# Altium schematic sheet BabyConditionMonitor.SchDoc: BabyConditionMonitor
size A2; DocumentNumber: 001; Revision: *.A; SheetNumber: 1; SheetTotal: 1
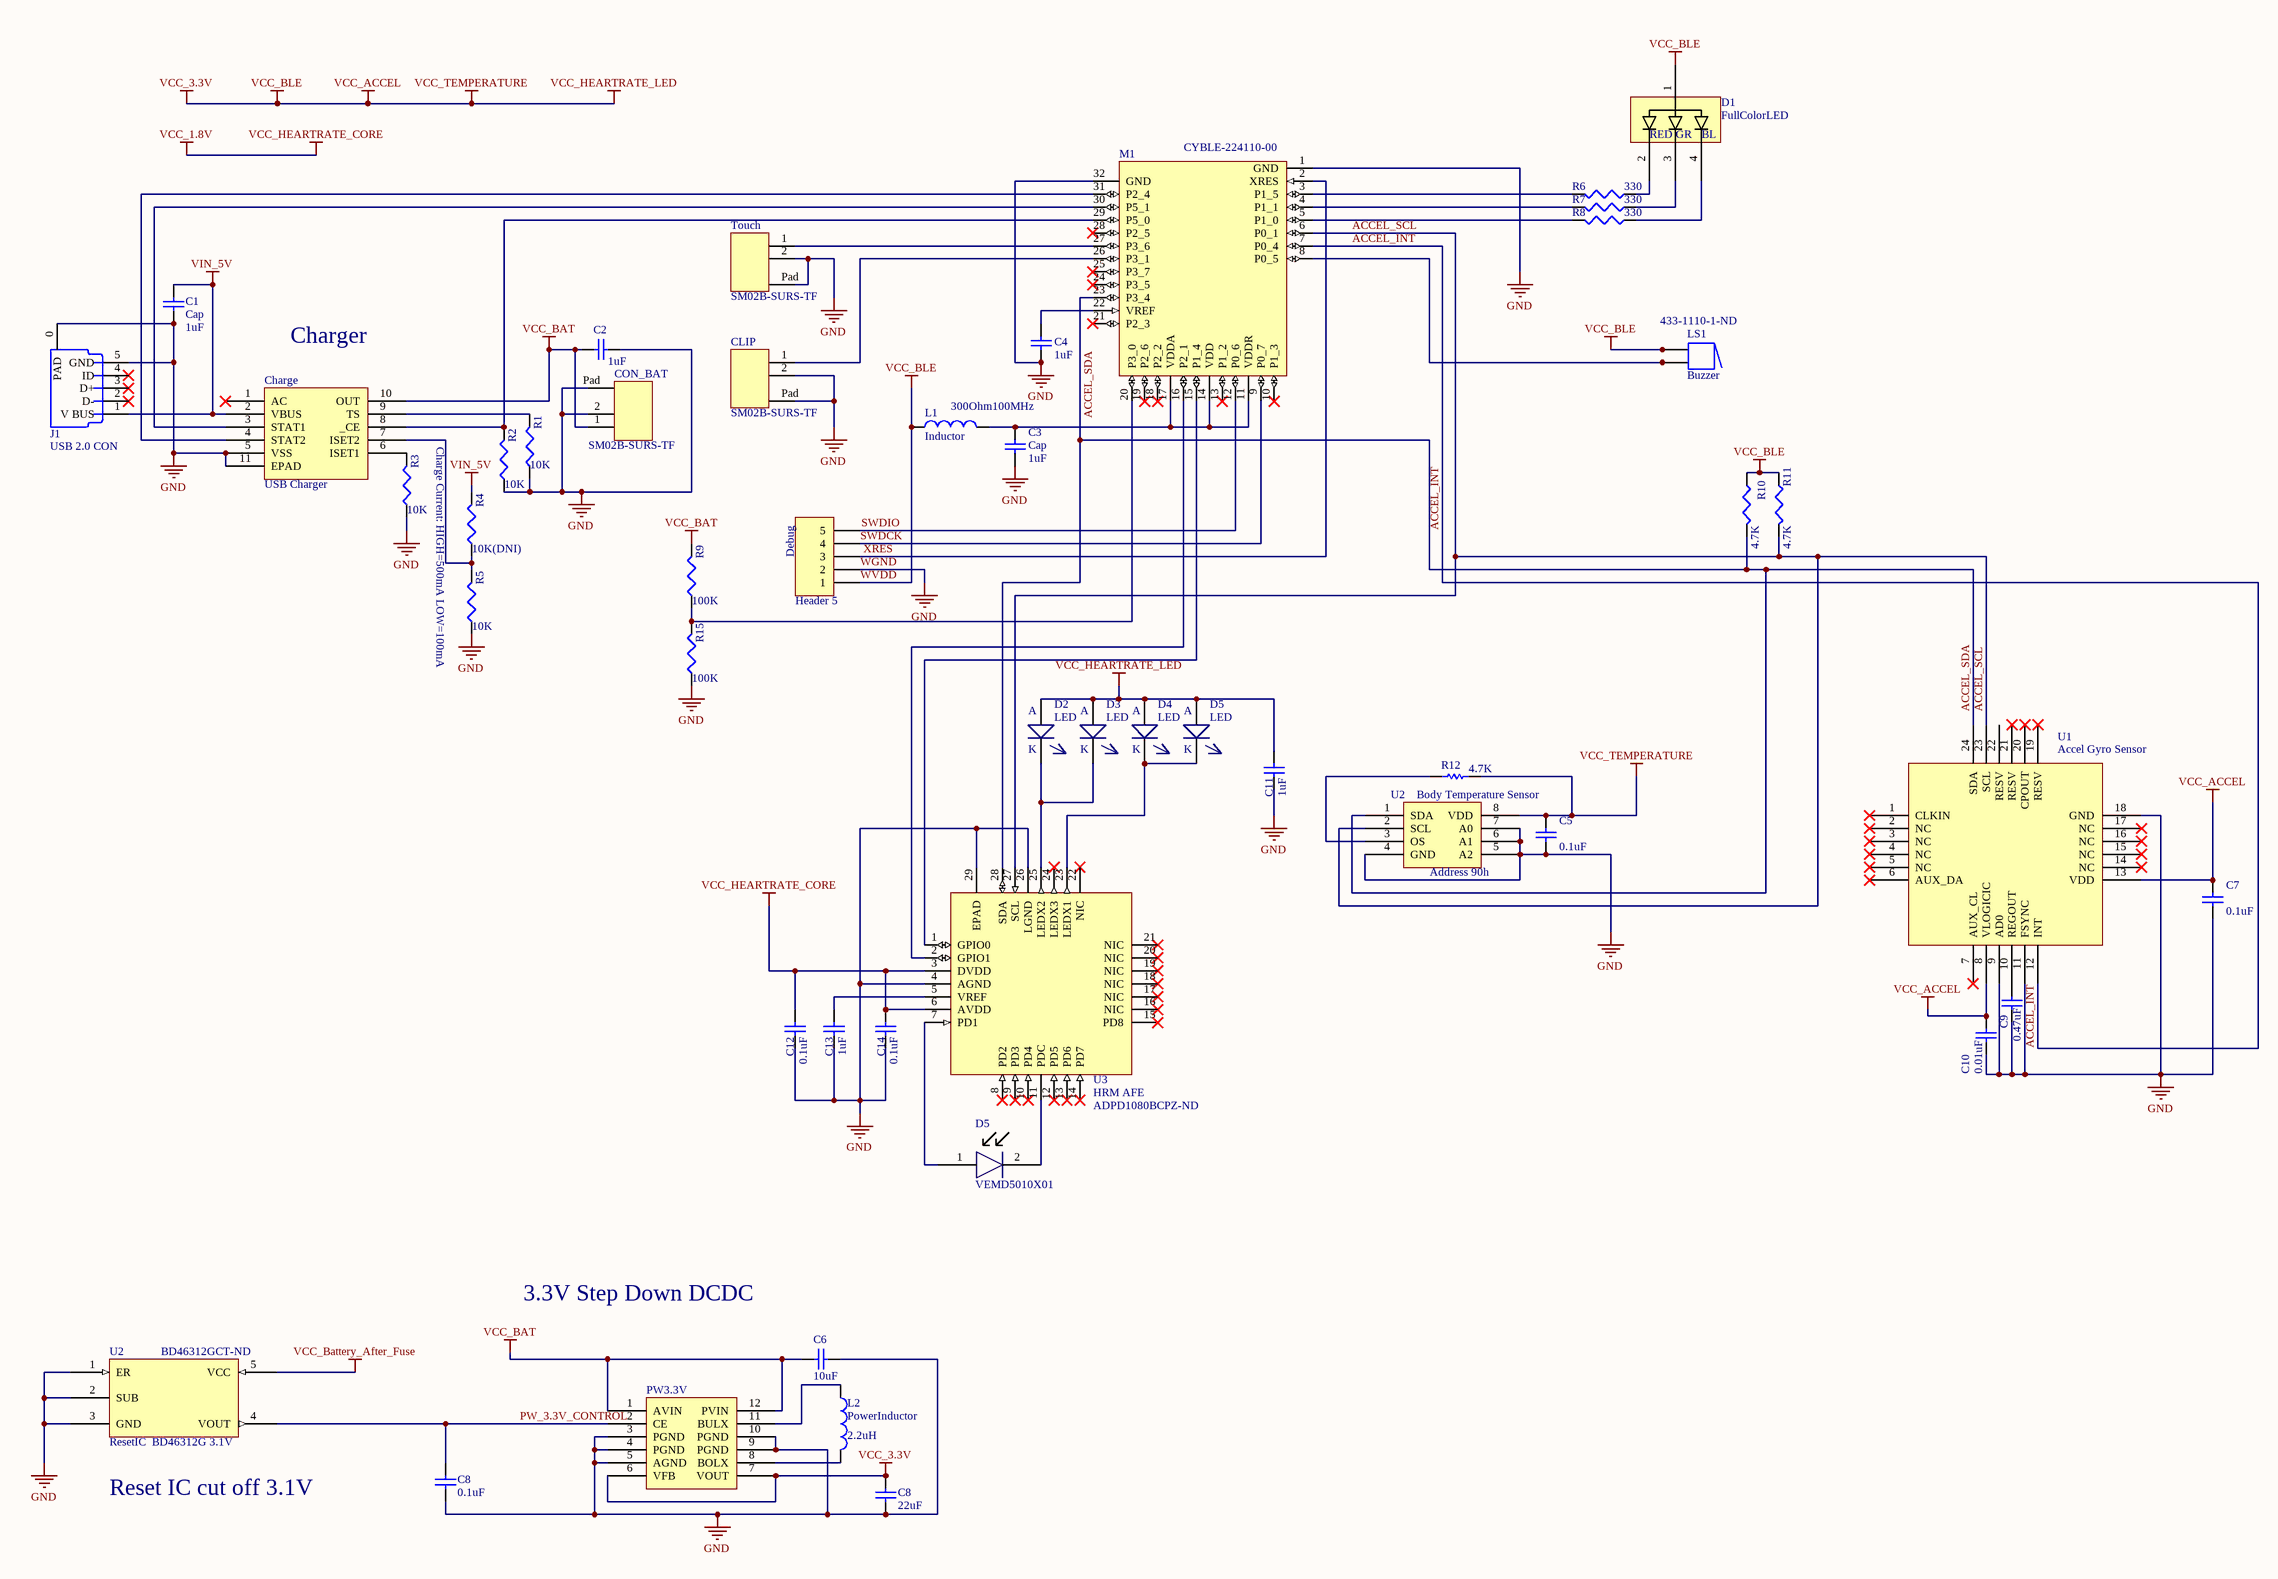
[diagram p0: BabyConditionMonitor.SchDoc]

## Parts
(Parts that share a designator on the sheet are numbered #1, #2 ... from top to bottom, then left to right.)
C1  Cap  value 1uF  [1005[0402] High Density]
C2  value 1uF  [1005[0402] High Density]  (hidden comment: Cap)
C3  Cap  value 1uF  [1005[0402] High Density]
C4  value 1uF  [1005[0402] High Density]  (hidden comment: Cap)
C5  value 0.1uF  [1005[0402] High Density]  (hidden comment: Cap)
C6  value 10uF  [1005[0402] High Density]  (hidden comment: Cap)
C7  value 0.1uF  [1005[0402] High Density]  (hidden comment: Cap)
C8#1  value 0.1uF  [1608[0603]]  (hidden comment: Cap)
C8#2  value 22uF  [1608[0603]]  (hidden comment: Cap)
C9  value 0.47uF  [1005[0402] High Density]  (hidden comment: Cap)
C10  value 0.01uF  [1005[0402] High Density]  (hidden comment: Cap)
C11  value 1uF  [1005[0402] High Density]  (hidden comment: Cap)
C12  value 0.1uF  [1005[0402] High Density]  (hidden comment: Cap)
C13  value 1uF  [1005[0402] High Density]  (hidden comment: Cap)
C14  value 0.1uF  [1005[0402] High Density]  (hidden comment: Cap)
Charge  USB Charger  [BQ24020]
CLIP  SM02B-SURS-TF  [SM02B-SURS-TF]
CON_BAT  SM02B-SURS-TF  [SM02B-SURS-TF]
D1  FullColorLED  [fullColorLED SMT]
D2  LED  [1608[0603] -LED]
D3  LED  [1608[0603] -LED]
D4  LED  [1608[0603] -LED]
D5#1  LED  [1608[0603] -LED]
D5#2  VEMD5010X01  [OPT Sensor VEMD5010X01]
Debug  Header 5  [MHDR1X5]
J1  USB 2.0 CON  [MicroUSB WaterProof]
L1  Inductor  value 300Ohm100MHz  [INDC1608L]
L2  PowerInductor  value 2.2uH  [Powerinductor]
LS1  Buzzer  Supplier Part Number 1: 433-1110-1-ND  [ST-0402T]
M1  CYBLE-224110-00  [CYBLE-224110-00]
PW3.3V  Buck Boost Converter  [RP604x]  (value not drawn)
R1  value 10K  [1005[0402] High Density]  (hidden comment: Res3)
R2  value 10K  [1005[0402] High Density]  (hidden comment: Res3)
R3  value 10K  [1005[0402] High Density]  (hidden comment: Res3)
R4  value 10K(DNI)  [1005[0402] High Density]  (hidden comment: Res3)
R5  value 10K  [1005[0402] High Density]  (hidden comment: Res3)
R6  value 330  [1005[0402] High Density]  (hidden comment: Res3)
R7  value 330  [1005[0402] High Density]  (hidden comment: Res3)
R8  value 330  [1005[0402] High Density]  (hidden comment: Res3)
R9  value 100K  [1005[0402] High Density]  (hidden comment: Res3)
R10  value 4.7K  [1005[0402] High Density]  (hidden comment: Res3)
R11  value 4.7K  [1005[0402] High Density]  (hidden comment: Res3)
R12  value 4.7K  [1005[0402] High Density]  (hidden comment: Res Semi)
R15  value 100K  [1005[0402] High Density]  (hidden comment: Res3)
Touch  SM02B-SURS-TF  [SM02B-SURS-TF]
U1  Accel Gyro Sensor  [MPU-6050]
U2#1  Body Temperature Sensor  [MAX30205]
U2#2  ResetIC  BD46312G 3.1V  Supplier Part Number 1: BD46312GCT-ND  [ResetIC  BD45xxx]
U3  HRM AFE  Supplier Part Number 1: ADPD1080BCPZ-ND  [ADPD1080]

## Nets
VCC_1.8V: C12.2 C14.2 U3.3(DVDD) U3.6(AVDD)  [also labelled VCC_HEARTRATE_CORE]
VCC_BAT: C2.1 C6.2 Charge.10(OUT) CON_BAT.1 PW3.3V.1(AVIN) PW3.3V.12(PVIN) R9.2
VCC_Battery_After_Fuse: U2#2.5(VCC)
VIN_5V: C1.1 Charge.2(VBUS) J1.1(V_BUS) R4.2
WGND: C1.2 C2.2 C3.1 C4.1 C5.1 C6.1 C7.1 C8#1.2 C8#2.2 C9.1 C10.1 C11.1 C12.1 C13.1 C14.1 Charge.5(VSS) Charge.11(EPAD) CLIP.2 CLIP.Pad CON_BAT.2 CON_BAT.Pad Debug.2 J1.0(PAD) J1.5(GND) M1.1(GND) M1.32(GND) PW3.3V.3(PGND) PW3.3V.4(PGND) PW3.3V.5(AGND) PW3.3V.9(PGND) PW3.3V.10(PGND) R1.1 R2.1 R3.1 R5.1 R15.1 Touch.2 Touch.Pad U1.9(AD0) U1.11(FSYNC) U1.18(GND) U2#1.4(GND) U2#1.5(A2) U2#1.6(A1) U2#1.7(A0) U2#2.1(ER) U2#2.2(SUB) U2#2.3(GND) U3.4(AGND) U3.26(LGND) U3.29(EPAD)  [also labelled GND]
WVDD: C5.2 C7.2 C8#2.1 C10.2 C11.2 D1.1 D2.1 D3.1 D4.1 D5#1.1 Debug.1 L1.1 LS1.1 LS1.1A PW3.3V.6(VFB) PW3.3V.7(VOUT) R10.1 R11.1 R12.1 U1.8(VLOGICIC) U1.13(VDD) U2#1.8(VDD)  [also labelled VCC_3.3V, VCC_ACCEL, VCC_BLE, VCC_HEARTRATE_LED, VCC_TEMPERATURE]
ACCEL_INT: M1.7(P0_4) U1.12(INT)
ACCEL_SCL: M1.6(P0_1) R11.2 U1.23(SCL) U2#1.2(SCL) U3.27(SCL)
ACCEL_SDA: M1.23(P3_4) R10.2 U1.24(SDA) U2#1.1(SDA) U3.28(SDA)
PW_3.3V_CONTROL: C8#1.1 PW3.3V.2(CE) U2#2.4(VOUT)
SWDCK: Debug.4 M1.9(P0_7)
SWDIO: Debug.5 M1.12(P0_6)
XRES: Debug.3 M1.2(XRES)
NetC3_2: C3.2 L1.2 M1.11(VDDR) M1.14(VDD) M1.17(VDDA)
NetC4_2: C4.2 M1.22(VREF)
NetC9_2: C9.2 U1.10(REGOUT)
NetC13_2: C13.2 U3.5(VREF)
NetCharge_3: Charge.3(STAT1) M1.30(P5_1)
NetCharge_4: Charge.4(STAT2) M1.31(P2_4)
NetCharge_6: Charge.6(ISET1) R3.2
NetCharge_7: Charge.7(ISET2) R4.1 R5.2
NetCharge_8: Charge.8(_CE) M1.29(P5_0) R2.2
NetCharge_9: Charge.9(TS) R1.2
NetCLIP_1: CLIP.1 M1.26(P3_1)
NetD1_2: D1.2 R6.1
NetD1_3: D1.3 R7.1
NetD1_4: D1.4 R8.1
NetD2_2: D2.2 D3.2 U3.25(LEDX2)
NetD4_2: D4.2 D5#1.2 U3.23(LEDX1)
NetD5#2_1: D5#2.1 U3.7(PD1)
NetD5#2_2: D5#2.2 U3.11(PDC)
NetL2_1: L2.1 PW3.3V.11(BULX)
NetL2_2: L2.2 PW3.3V.8(BOLX)
NetLS1_2: LS1.2 LS1.2A M1.8(P0_5)
NetM1_3: M1.3(P1_5) R6.2
NetM1_4: M1.4(P1_1) R7.2
NetM1_5: M1.5(P1_0) R8.2
NetM1_15: M1.15(P1_4) U3.1(GPIO0)
NetM1_16: M1.16(P2_1) U3.2(GPIO1)
NetM1_20: M1.20(P3_0) R9.1 R15.2
NetM1_27: M1.27(P3_6) Touch.1
NetR12_2: R12.2 U2#1.3(OS)

Not connected (* = marked no-connect by the designer): Charge 1(AC)*; J1 2(D-)* 3(D+)* 4(ID)*; M1 10(P1_3)* 13(P1_2)* 18(P2_2)* 19(P2_6)* 21(P2_3)* 24(P3_5)* 25(P3_7)* 28(P2_5)*; U1 1(CLKIN)* 2(NC)* 3(NC)* 4(NC)* 5(NC)* 6(AUX_DA)* 7(AUX_CL)* 14(NC)* 15(NC)* 16(NC)* 17(NC)* 19(RESV)* 20(CPOUT)* 21(RESV)* 22(RESV); U3 8(PD2)* 9(PD3)* 10(PD4)* 12(PD5)* 13(PD6)* 14(PD7)* 15(PD8)* 16(NIC)* 17(NIC)* 18(NIC)* 19(NIC)* 20(NIC)* 21(NIC)* 22(NIC)* 24(LEDX3)*

## Notes on the sheet
- Charger
- Charge Current: HIGH=500mA LOW=100mA
- (near U2#1) Address 90h
- 3.3V Step Down DCDC
- Reset IC cut off 3.1V
- Title
- Size:
- Date:
- File:
- A2
- Number:
- Time:
- Revision:
- Sheet
- of
- (in symbol FullColorLED) RED; GR; BL
- (in symbol LED) A; K

## Library data of the parts
C1-C7 C8#1 C8#2 C9-C14 = Cap: Capacitor; Published: 8-Jun-2000; LatestRevisionDate: 17-Jul-2002; LatestRevisionNote: Re-released for DXP Platform.; PackageReference: RAD-0.3; Publisher: Altium Limited; PackageDescription: Radial Cap, Thru-Hole; 2 Leads; 0.3 in Pin Spacing
Charge = BQ2402X: PartNo: BQ24020
D1 = FullColorLED: PartNo: OSTB0603C1C-A
D2-D4 D5#1 = LED: LED SMD; Manufacturer: Kingbright; Manufacturer Part Number: APTD1608CGCK; Description: LED GREEN CLEAR CHIP SMD; Color: Green; Forward Voltage: 2.1V; Luminous Intensity: 180mcd; Viewing Angle: 60°; Dominant Wavelength: 570nm; Test Current: 20mA; Lens Style: Clear; Supplier 1: Digi-Key; Supplier Part Number 1: 754-1545-1-ND; Stock 1: 692051; Pricing 1: 1=0.50000, 10=0.35300, 100=0.20580, 500=0.14112, 1000=0.11760 (USD); RoHS: Yes; Mount: Surface Mount; Case/Package: 0603; Case Code (Metric): 1608; Case Code (Imperial): 0603; Min Operating Temperature: -40°C; Max Operating Temperature: 85°C; Packaging: Tape and Reel; Package Quantity: 2000; Illumination Color: Green; Forward Current: 20mA; Length: 1.6mm; Height: 0.95mm; Width: 0.8mm; Lead Free: Lead Free; ComponentLink1URL: https://datasheet.ciiva.com/4688/aptd1608cgck-24861-4688176.pdf?src-supplier=Mouser; ComponentLink1Description: https://datasheet.ciiva.com/4688/aptd1608cgck-24861-4688176.pdf?src-supplier=Mouser; ComponentLink2URL: https://datasheet.ciiva.com/2114/aptd1608cgck-2114089.pdf?src-supplier=Digi-Key; ComponentLink2Description: https://datasheet.ciiva.com/2114/aptd1608cgck-2114089.pdf?src-supplier=Digi-Key; ComponentLink3URL: https://datasheet.ciiva.com/2114/aptd1608cgck-2114091.pdf?src-supplier=Digi-Key; ComponentLink3Description: https://datasheet.ciiva.com/2114/aptd1608cgck-2114091.pdf?src-supplier=Digi-Key; ComponentLink4URL: https://datasheet.ciiva.com/16415/aptd1608cgck-16415403.pdf?src-supplier=Future+Electronics; ComponentLink4Description: https://datasheet.ciiva.com/16415/aptd1608cgck-16415403.pdf?src-supplier=Future+Electronics
Debug = Header 5: Header, 5-Pin; LatestRevisionDate: 17-Jul-2002; LatestRevisionNote: Re-released for DXP Platform.; Publisher: Altium Limited
J1 = USBConnector: USB2.0 Connector; PartNo: DX4RNW5HJ3R1000; Manufacture: Molex; PCB_Layout: Complies with Manufacturer's Recommendation.; Published: 30-May-2008; DatasheetVersion: rev0, Mar-2004; PackageVersion: rev0, Mar-2004; PackageReference: 5000750517; Publisher: Altium Limited; PackageDescription: USB Mini-B, Type 2, Thru-Hole; 5 Position; Vertical, Body 7.7 x 4.2 x 7.7 mm (LxWxH); ComponentLink1Description: Manufacturer Link; ComponentLink1URL: http://www.molex.com/; ComponentLink2Description: Datasheet; ComponentLink2URL: http://www.molex.com/pdm_docs/sd/5000750517_sd.pdf
L1 = Inductor: Code_IEC: 1005; Published: 8-Jun-2000; LatestRevisionDate: 29-May-2009; LatestRevisionNote: IPC-7351 Footprint Added.; PackageReference: 0402-A; Publisher: Altium Limited; PackageDescription: Chip Inductor; Code_JEITA: 0402
L2 = PowerInductor: PartNo: CDRH2D14NP-2R2NC; Manufacture: Sumida
LS1 = Buzzer: Magnetic Transducer Buzzer; Published: 24-Mar-1999; LatestRevisionDate: 17-Dec-2003; LatestRevisionNote: Schematic revised, PCB Footprint replaced.; DatasheetVersion: 17-Dec-2003; PackageReference: ABSM-1574; Publisher: Altium Limited; PackageDescription: Magnetic Transducer Buzzer; ComponentLink1Description: Manufacturer Link; ComponentLink1URL: http://www.megastar.com/linecard/buzzmode/index.php; Supplier 1: Digi-Key
M1 = CYBLE-224110-00: BLE Module Long Range
PW3.3V = RP604x: Manufacture: Ricoh; PartNo: RP604K331A
R1-R11 R15 = Res3: Resistor; Published: 8-Jun-2000; LatestRevisionDate: 29-May-2009; LatestRevisionNote: IPC-7351 Footprint Added.; PackageReference: J1-0603; Publisher: Altium Limited; PackageDescription: Chip Resistor
R12 = Res Semi: Semiconductor Resistor; Published: 8-Jun-2000; LatestRevisionDate: 17-Jul-2002; LatestRevisionNote: Re-released for DXP Platform.; PackageReference: AXIAL-0.5; Publisher: Altium Limited
U1 = MPU-6050: Manufacture: TDK InvenSense; PartNo: ICM-20689
U2#1 = MAX30205: Body Temperature Sebsor; Manufature: Maxim; PartNo: MAX30205
U2#2 = ResetIC: RESET IC 3.4V; Manufacturer: Rohm; Manufacturer Part Number: BD46312G-TR; Min Supply Voltage: 950mV; Max Supply Voltage: 10V; Max Power Dissipation: 540mW; Number of Voltages Monitored: 1; Reset: Active Low; Reset Timeout: 180ms; Max Supply Current: 2.85uA; Watchdog Timer: No; Min Reset Threshold Voltage: 3.069V; Max Reset Threshold Voltage: 3.131V; Nominal Supply Current: 850nA; Supply: BD46312GCT-ND; Supplier 1: Digi-Key; Stock 1: 5207; Pricing 1: 1 = 0.68000, 10 = 0.59800, 25 = 0.56200, 100 = 0.45860, 250 = 0.42600, 500 = 0.36256, 1000 = 0.29005 (USD); RoHS: Yes; Mount: Surface Mount; Case/Package: SSOP; Number of Pins: 5; Min Operating Temperature: -40°C; Max Operating Temperature: 105°C; Type: Simple Reset/Power-On Reset; Package Quantity: 3000; Packaging: Tape and Reel; Threshold Voltage: 3.1V; Radiation Hardening: No; REACH SVHC: Unknown; Lead Free: Lead Free; ComponentLink1URL: https://datasheet.ciiva.com/1969/bd45xxg-e-1969417.pdf?src-supplier=Digi-Key; ComponentLink1Description: https://datasheet.ciiva.com/1969/bd45xxg-e-1969417.pdf?src-supplier=Digi-Key; ComponentLink2URL: https://datasheet.ciiva.com/1969/bd45xxg-e-1969418.pdf?src-supplier=Digi-Key; ComponentLink2Description: https://datasheet.ciiva.com/1969/bd45xxg-e-1969418.pdf?src-supplier=Digi-Key; ComponentLink3URL: https://datasheet.ciiva.com/22735/1747265-22735802.pdf?src-supplier=Element14; ComponentLink3Description: https://datasheet.ciiva.com/22735/1747265-22735802.pdf?src-supplier=Element14; ComponentLink4URL: https://datasheet.ciiva.com/1969/bd45xxg-e-1969419.pdf?src-supplier=Digi-Key; ComponentLink4Description: https://datasheet.ciiva.com/1969/bd45xxg-e-1969419.pdf?src-supplier=Digi-Key
U3 = ADPD1080: Manufacturer: Analog Devices; Manufacturer Part Number: ADPD1080BCPZ; Supplier 1: Digi-Key; Stock 1: 338; Pricing 1: 1 = 6.55000, 10 = 5.91300, 100 = 4.89500, 500 = 4.26250, 1000 = 3.71250 (USD)